# EAGLE design banana-split (EAGLE 6.6.0)
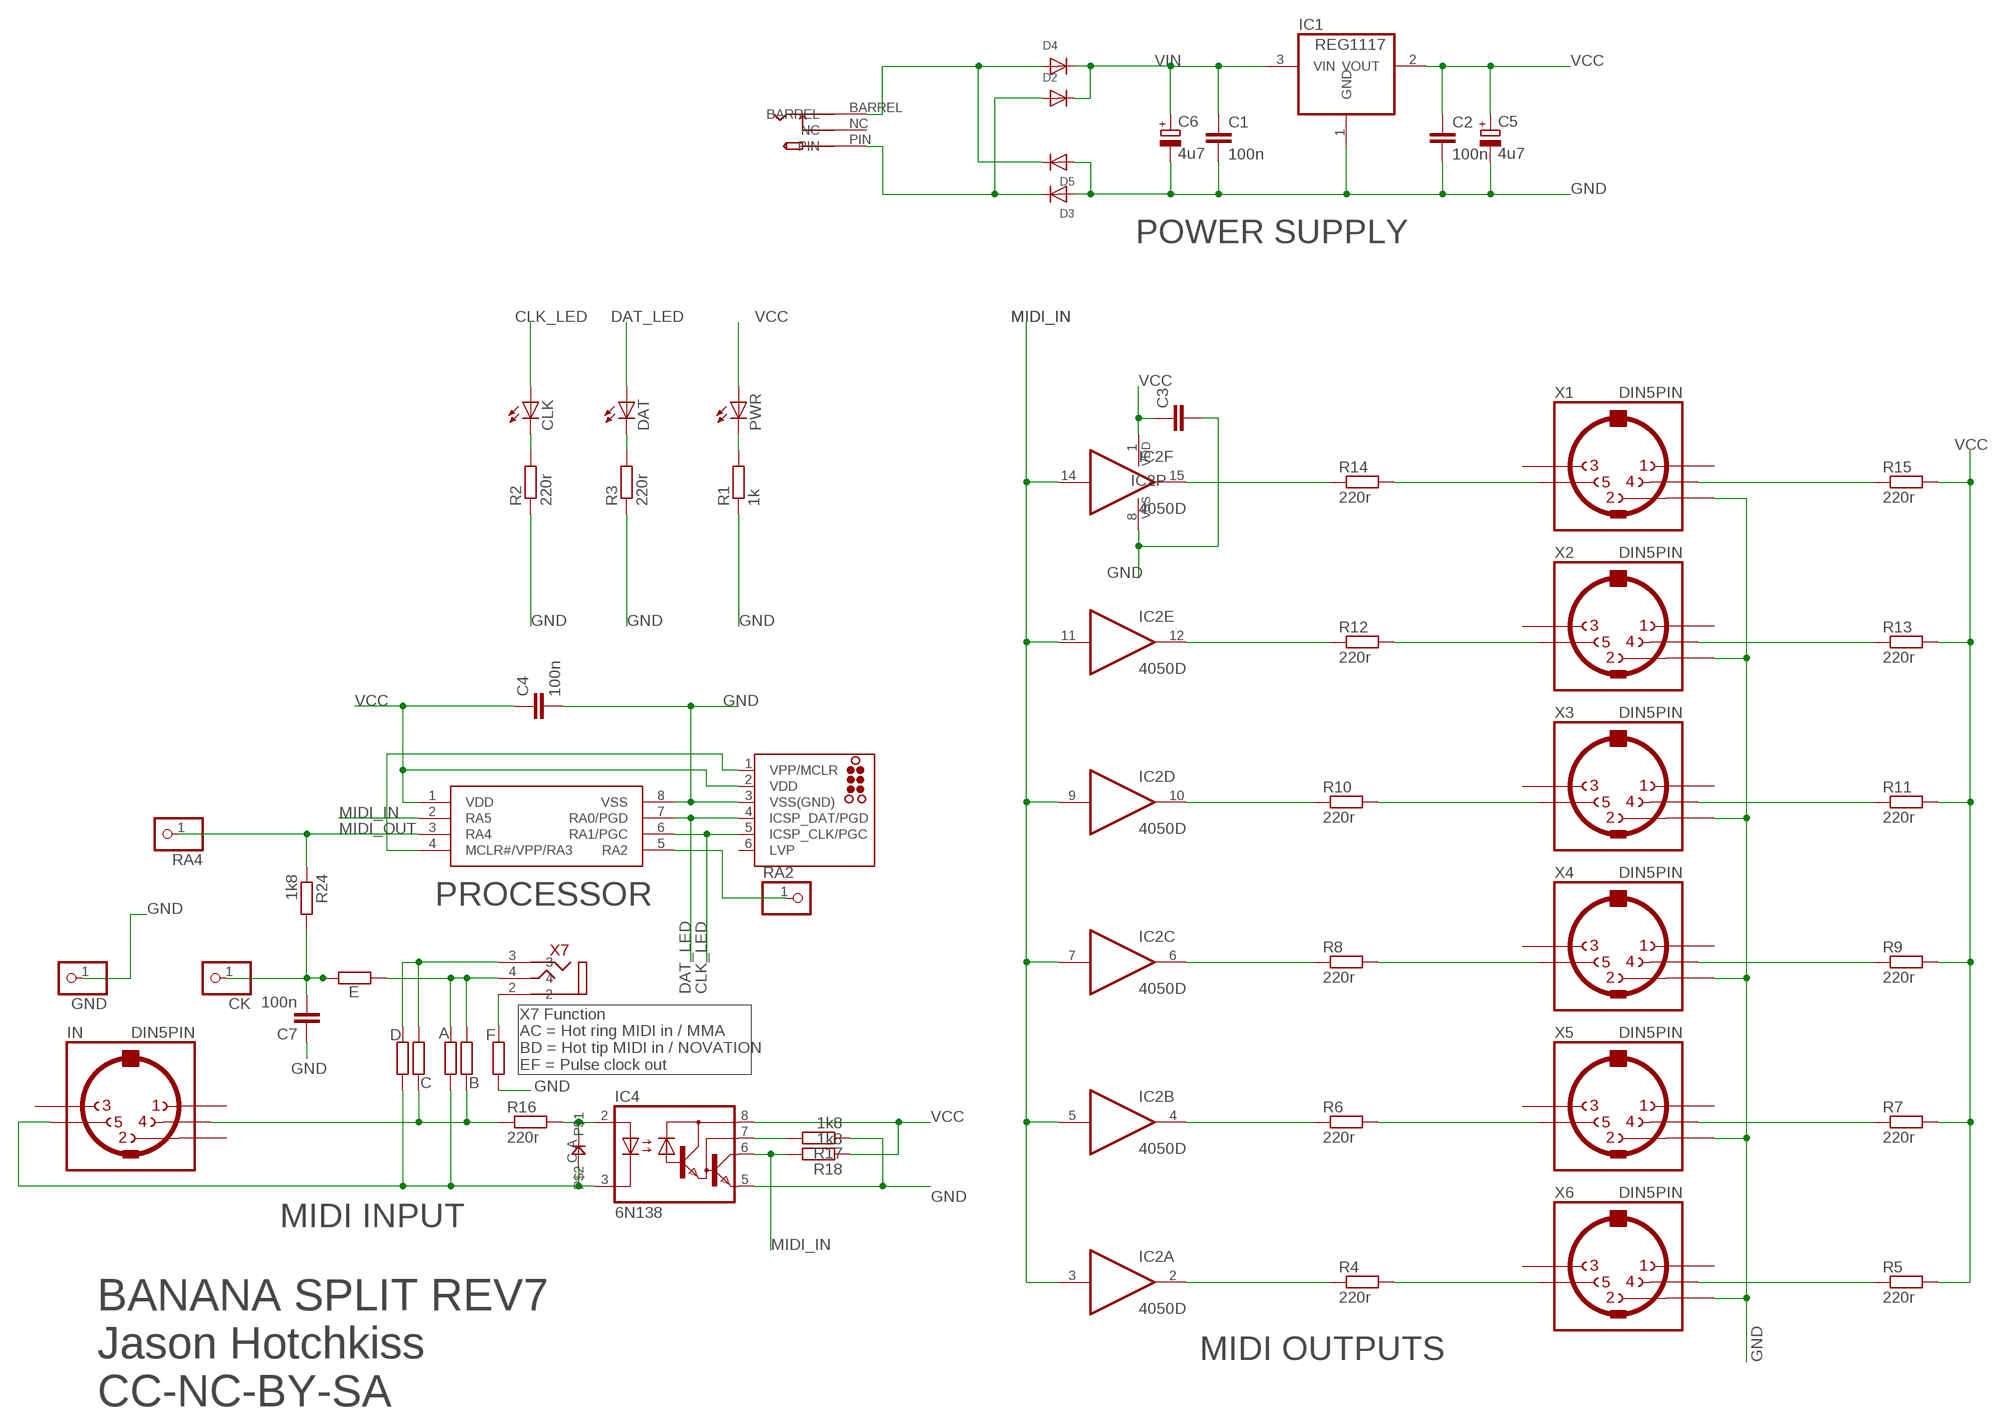
[diagram p0: schematic, sheet 1]

## Parts
A  1k8  R-EU_R0805  [R0805]
B  1k8  R-EU_R0805  [R0805]
C  1k8  R-EU_R0805  [R0805]
C1  100n  C-EUC0805  [C0805]
C2  100n  C-EUC0805  [C0805]
C3  C-EUC0805  [C0805]
C4  100n  C-EUC0805  [C0805]
C5  4u7  CPOL-EUE2-4  [E2-4]
C6  4u7  CPOL-EUE2-4  [E2-4]
C7  100n  C-EUC0805  [C0805]
CK  PINHD-1X1  [1X01]
CLK  LED3MM  [LED3MM]
D  1k8  R-EU_R0805  [R0805]
D1  0805DIODE  [0805DIODE]
D2  DIODESOD-123  [SOD-123]
D3  DIODESOD-123  [SOD-123]
D4  DIODESOD-123  [SOD-123]
D5  DIODESOD-123  [SOD-123]
DAT  LED3MM  [LED3MM]
E  1k8  R-EU_R0805  [R0805]
F  1k8  R-EU_R0805  [R0805]
GND  PINHD-1X1  [1X01]
IC1  REG1117  [SOT223]
IC2  4050D  [SO16]
IC3  PIC12F1822SO08  [SO08]
IC4  6N138  [DIL08]
ICSP  TC2030-MCP-NL  [TC2030-MCP-NL]
IN  DIN5PIN  [EDGEDIN]
PWR  LED3MM  [LED3MM]
R1  1k  R-EU_R0805  [R0805]
R2  220r  R-EU_R0805  [R0805]
R3  220r  R-EU_R0805  [R0805]
R4  220r  R-EU_R0805  [R0805]
R5  220r  R-EU_R0805  [R0805]
R6  220r  R-EU_R0805  [R0805]
R7  220r  R-EU_R0805  [R0805]
R8  220r  R-EU_R0805  [R0805]
R9  220r  R-EU_R0805  [R0805]
R10  220r  R-EU_R0805  [R0805]
R11  220r  R-EU_R0805  [R0805]
R12  220r  R-EU_R0805  [R0805]
R13  220r  R-EU_R0805  [R0805]
R14  220r  R-EU_R0805  [R0805]
R15  220r  R-EU_R0805  [R0805]
R16  220r  R-EU_R0805  [R0805]
R17  1k8  R-EU_R0805  [R0805]
R18  1k8  R-EU_R0805  [R0805]
R24  1k8  R-EU_R0805  [R0805]
RA2  PINHD-1X1  [1X01]
RA4  PINHD-1X1  [1X01]
U$1  PWR_SOCKET_2_1MM  [PWR_SOCKET_2_1MM]
X1  DIN5PIN  [EDGEDIN]
X2  DIN5PIN  [EDGEDIN]
X3  DIN5PIN  [EDGEDIN]
X4  DIN5PIN  [EDGEDIN]
X5  DIN5PIN  [EDGEDIN]
X6  DIN5PIN  [EDGEDIN]
X7  VERTICAL_3_5MM_SOCKET  [VERTICAL_3_5MM_SOCKET]

## Nets
CLK: CLK.K(C) R2.2
CLK_LED: CLK.A IC3.6(RA1/PGC) ICSP.5(ICSP_CLK/PGC)
DAT_LED: DAT.A IC3.7(RA0/PGD) ICSP.4(ICSP_DAT/PGD)
GND: C1.2 C2.2 C3.2 C4.2 C5.- C6.- C7.1 D3.A D5.A F.1 GND.1 IC1.1(GND) IC2.8(P:VSS) IC3.8(VSS) IC4.5(GND) ICSP.3(VSS(GND)) R1.1 R2.1 R3.1 R17.1 X1.2 X2.2 X3.2 X4.2 X5.2 X6.2
MIDI_IN: IC2.3(A:I) IC2.5(B:I) IC2.7(C:I) IC2.9(D:I) IC2.11(E:I) IC2.14(F:I) IC3.2(RA5) IC4.6(VO) R18.2
MIDI_OUT: IC3.3(RA4) R24.1 RA4.1
N$1: R14.2 X1.5
N$2: R12.2 X2.5
N$3: R10.2 X3.5
N$4: R8.2 X4.5
N$5: R6.2 X5.5
N$6: R4.2 X6.5
N$7: IC2.15(F:O) R14.1
N$8: IC2.12(E:O) R12.1
N$9: IC2.10(D:O) R10.1
N$10: IC2.6(C:O) R8.1
N$11: IC2.2(A:O) R4.1
N$12: IC2.4(B:O) R6.1
N$13: PWR.K(C) R1.2
N$14: R15.1 X1.4
N$15: R13.1 X2.4
N$16: R11.1 X3.4
N$17: R9.1 X4.4
N$18: R7.1 X5.4
N$19: R5.1 X6.4
N$20: B.1 C.1 IN.4 R16.1
N$21: D1.A IC4.2(A) R16.2
N$22: IC4.7(VB) R17.2
N$23: DAT.K(C) R3.2
N$24: A.1 D1.C D.1 IC4.3(C) IN.5
N$25: IC3.5(RA2) RA2.1
N$26: C.2 D.2 X7.3
N$27: D4.A D5.C U$1.BARREL
N$28: D2.A D3.C U$1.PIN
N$29: F.2 X7.2
N$30: A.2 B.2 E.2 X7.4
N$31: C7.2 CK.1 E.1 R24.2
N$33: IC3.4(MCLR#/VPP/RA3) ICSP.1(VPP/MCLR)
VCC: C2.1 C3.1 C4.1 C5.+ IC1.2(VOUT) IC2.1(P:VDD) IC3.1(VDD) IC4.8(VCC) ICSP.2(VDD) PWR.A R5.2 R7.2 R9.2 R11.2 R13.2 R15.2 R18.1
VIN: C1.1 C6.+ D2.C D4.C IC1.3(VIN)
Unconnected: ICSP.6(LVP) IN.1 IN.2 IN.3 U$1.NC X1.1 X1.3 X2.1 X2.3 X3.1 X3.3 X4.1 X4.3 X5.1 X5.3 X6.1 X6.3

## Notes on the sheet
- POWER SUPPLY
- PROCESSOR
- X7 Function
  AC = Hot ring MIDI in / MMA
  BD = Hot tip MIDI in / NOVATION
  EF = Pulse clock out
- MIDI INPUT
- BANANA SPLIT REV7
- MIDI OUTPUTS
- Jason Hotchkiss
  CC-NC-BY-SA

## Library data of the parts
A B C D E F R1-R18 R24 = rcl:R-EU_: RESISTOR, European symbol
C1-C4 C7 = rcl:C-EU: CAPACITOR, European symbol
C5 C6 = rcl:CPOL-EU: POLARIZED CAPACITOR, European symbol
CK GND RA2 RA4 = pinhead:PINHD-1X1: PIN HEADER
CLK DAT PWR = led:LED: LED OSRAM: - CHIPLED LG R971, LG N971, LY N971, LG Q971, LY Q971, LO R971, LY R971 LH N974, LH R974 LS Q976, LO Q976, LY Q976 LO Q996 - Hyper CHIPLED LW Q18S LB Q993, LB Q99A, LB R99A - SideLED LS A670, LO A670, LY A670, LG A670, LP A670 LB A673, LV A673, LT A673, LW A673 LH A674 LY A675 LS A676, LA A676, LO A676, LY A676, LW A676 LS A679, LY A679, LG A679 - Hyper Micro SIDELED® LS Y876, LA Y876, LO Y876, LY Y876 LT Y87S - SmartLED LW L88C, LW L88S LB L89C, LB L89S, LG L890 LS L89K, LO L89K, LY L89K LS L896, LA L896, LO L896, LY L896 - TOPLED LS T670, LO T670, LY T670, LG T670, LP T670 LSG T670, LSP T670, LSY T670, LOP T670, LYG T670 LG T671, LOG T671, LSG T671 LB T673, LV T673, LT T673, LW T673 LH T674 LS T676, LA T676, LO T676, LY T676, LB T676, LH T676, LSB T676, LW T676 LB T67C, LV T67C, LT T67C, LS T67K, LO T67K, LY T67K, LW E67C LS E67B, LA E67B, LO E67B, LY E67B, LB E67C, LV E67C, LT E67C LW T67C LS T679, LY T679, LG T679 LS T770, LO T770, LY T770, LG T770, LP T770 LB T773, LV T773, LT T773, LW T773 LH T774 LS E675, LA E675, LY E675, LS T675 LS T776, LA T776, LO T776, LY T776, LB T776 LHGB T686 LT T68C, LB T68C - Hyper Mini TOPLED® LB M676 - Mini TOPLED Santana® LG M470 LS M47K, LO M47K, LY M47K Source: http://www.osram.convergy.de LUXEON: - LUMILED® LXK2-PW12-R00, LXK2-PW12-S00, LXK2-PW14-U00, LXK2-PW14-V00 LXK2-PM12-R00, LXK2-PM12-S00, LXK2-PM14-U00 LXK2-PE12-Q00, LXK2-PE12-R00, LXK2-PE12-S00, LXK2-PE14-T00, LXK2-PE14-U00 LXK2-PB12-K00, LXK2-PB12-L00, LXK2-PB12-M00, LXK2-PB14-N00, LXK2-PB14-P00, LXK2-PB14-Q00 LXK2-PR12-L00, LXK2-PR12-M00, LXK2-PR14-Q00, LXK2-PR14-R00 LXK2-PD12-Q00, LXK2-PD12-R00, LXK2-PD12-S00 LXK2-PH12-R00, LXK2-PH12-S00 LXK2-PL12-P00, LXK2-PL12-Q00, LXK2-PL12-R00 Source: www.luxeon.com KINGBRIGHT: KA-3528ASYC Source: www.kingbright.com
D1 = jasons_stuff:0805DIODE
D2-D5 = adafruit:DIODE: Diode SMADIODE - SMA Surface Mount Package 20V 1A Schottky Diode Digikey: 641-1014-6-ND DO-1N4148 - Through Hole Small Current Diode SOD-123 20V 1 A (.5mV Vf) Schottky Diode - Digikey: MBRX120TPMSCT-ND SOD-323 10V 570mA (.38mV Vf, 3ns) Schottky Diode - Digikey: ZLLS410CT-ND SOD-523 30V 30mA Schottky Diode (RB751S-40TE61) - Digikey: RB751S-40TE61CT-ND SOT23-R/W - SOT23 Package (R = Solder Paste/Reflow Ovens, W = Hand-Soldering) BAT54Film 40V 300mA - Digikey: 497-7162-1-ND
IC1 = burr-brown:REG1117: 800mA and 1A Low Dropout (LDO) Positive Regulator 1.8V, 2.5V, 2.85V, 3.3V, 5V, and Adj; MPN: REG1117; OC_FARNELL: 1097566; OC_NEWARK: 14P6981
IC2 = 40xx:4050: Hex non-inverting BUFFER
IC3 = jasons_stuff:PIC12F1822
IC4 = optocoupler:6N138: MOTOROLA OPTO COUPLER; MF: VISHAY/TELEFUNKEN; MPN: 6N138; OC_FARNELL: 9860150; OC_NEWARK: 35K5294
ICSP = tag-connect:TC2030: TAG-CONNECT ICSP Connector Manufacturer: Tag-Connect <http://www.tag-connect.com> Cable for easy In-Circuit Serial Programming. Designed for Microchip ICD2, suitable for many others. Two variants - one "with legs" (for hands-free fit on PCB) and another "without legs" for quick programming. PAD Description 1 MCLR/Vpp 2 Vdd 3 GND 4 PGD (ISPDAT) 5 PGC (ISPCLK) 6 nc (used for LVP) ©2009 ROFA.cz - modified and updated by Robert Darlington ‹rdarlington@gmail.com›
IN X1-X6 = jason_eagle6:DIN5PIN: Female CONNECTOR 5 pins 90 deg. with shield, horizontal (DIN 41524)
U$1 = jason_eagle6:PWR_SOCKET_2_1MM
X7 = jason_eagle6:VERTICAL_3_5MM_SOCKET

## Board
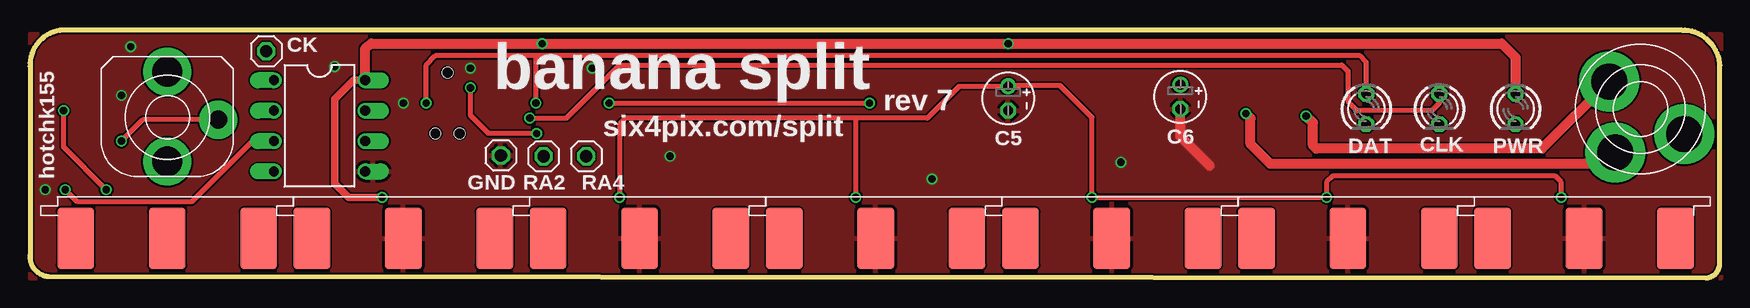
[diagram p1: board, top side]
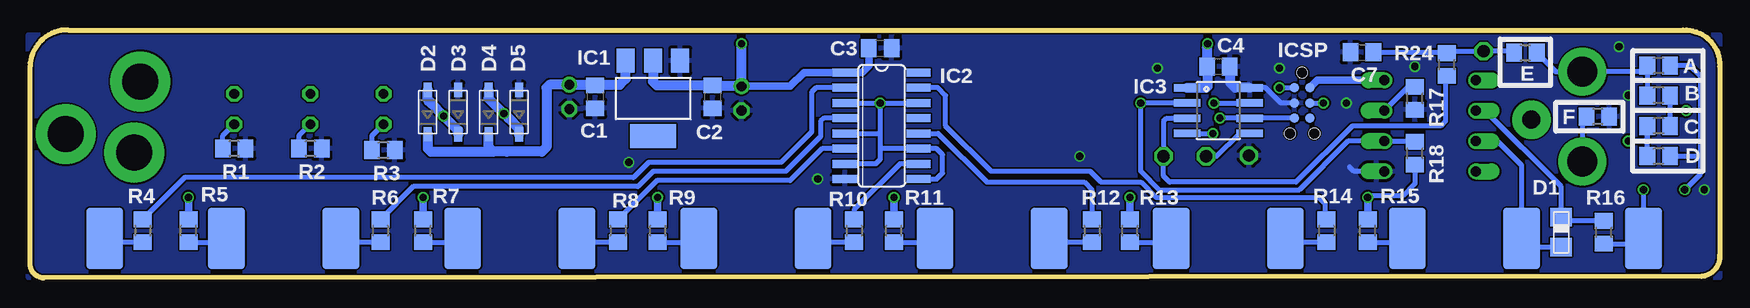
[diagram p2: board, bottom side, seen from below]

Size 140.85 x 20.7 mm. Coordinates in mm from the lower left corner, seen from the top.
Outline: 137.67,20.7 3.05,20.7 arc95 0,17.65 0,1.91 arc90 1.53,0.13 139.7,0 arc90 140.85,1.27 140.85,17.65 arc90 137.67,20.7
Copper layers (1*16): Top 0.035mm / dielectric 1.5mm / Bottom 0.035mm
Design rules "hackvana": minimum track width 6mil, minimum drill 0.3mm, track to track 6mil, track to pad 9mil, pad to pad 6mil, via to via 6mil, smd to smd 0mil, copper to edge 6mil, drill to drill 6mil, minimum pad ring 10mil, minimum via ring 6mil, stop-mask expansion 2mil, vias tented up to drill 100mil, thermal gap 10mil

### Footprints (pad centres in the part's own frame; a part is rotated, then mirrored left to right if it is on the bottom)
R0805 = smd 1.3 x 1.5: 1 -0.95,0; 2 0.95,0
C0805 = smd 1.3 x 1.5: 1 -0.95,0; 2 0.95,0
E2-4 = drill 0.813 pad 1.27: + -1.016,0 | drill 0.813 pad 1.27 octagon: - 1.016,0
1X01 = drill 1.016 octagon: 1 0,0
LED3MM = drill 0.813 octagon: A -1.27,0; K 1.27,0
0805DIODE = smd 1.524 x 1.778: A -1.262,-0.005; C 1.238,-0.005
SOD-123 = smd 1.2 x 0.7: A 1.85,0; C -1.85,0
SOT223 = smd 1.499 x 2.007: 1 -2.261,-3.15; 2 0.025,-3.15; 3 2.311,-3.15 | smd 3.81 x 2.007: 4 0,3.15
SO16 = smd 0.66 x 2.032: 1 -4.445,-3.073; 2 -3.175,-3.073; 3 -1.905,-3.073; 4 -0.635,-3.073; 5 0.635,-3.073; 6 1.905,-3.073; 7 3.175,-3.073; 8 4.445,-3.073; 9 4.445,3.073; 10 3.175,3.073; 11 1.905,3.073; 12 0.635,3.073; 13 -0.635,3.073; 14 -1.905,3.073; 15 -3.175,3.073; 16 -4.445,3.073
SO08 = smd 0.61 x 2.21: 1 -1.905,-2.616; 2 -0.635,-2.616; 3 0.635,-2.616; 4 1.905,-2.616; 5 1.905,2.616; 6 0.635,2.616; 7 -0.635,2.616; 8 -1.905,2.616
DIL08 = drill 0.813 offset: 1 -3.81,-3.81; 2 -1.27,-3.81; 3 1.27,-3.81; 4 3.81,-3.81; 5 3.81,3.81; 6 1.27,3.81; 7 -1.27,3.81; 8 -3.81,3.81
TC2030-MCP-NL = smd 0.787 x 0.787: 1 1.27,-0.635; 2 1.27,0.635; 3 2.54,-0.635; 4 2.54,0.635; 5 3.81,-0.635; 6 3.81,0.635 | hole 0.889: 0,0; 5.08,-1.016; 5.08,1.016
EDGEDIN = smd 3.048 x 5.08: 1 -7.62,-10.16; 2 0,-10.16; 3 7.62,-10.16 | smd 3.048 x 5.08 bottom: 4 -5.08,-10.16; 5 5.08,-10.16
PWR_SOCKET_2_1MM = drill 3 pad 5: BARREL 0,4.2; NC -4.2,0; PIN 3.4,-0.7
VERTICAL_3_5MM_SOCKET = drill 2.5 pad 4: 2 0,-3.75; 4 0,3.75 | drill 1.5 pad 3.2: 3 4.25,-0.25

### Placement (x,y rotation side)
A  5.08,17.72 180 bottom
B  5.08,15.24 180 bottom
C  5.08,12.7 180 bottom
C1  93.73,15.11 270 bottom
C2  83.95,15.11 270 bottom
C3  69.98,19.18 0 bottom
C4  41.79,17.65 0 bottom
C5  81.54,14.99 270 top
C6  95.89,15.11 270 top
C7  29.82,18.83 0 bottom
CK  19.69,18.92 0 top
CLK  117.48,14.1 270 top
D  5.08,10.16 180 bottom
D1  13.21,3.81 270 bottom
D2  107.7,13.84 90 bottom
D3  105.16,13.84 90 bottom
D4  102.62,13.84 90 bottom
D5  100.08,13.84 90 bottom
DAT  111.38,14.1 270 top
E  16.2,18.8 0 bottom
F  10.16,13.46 180 bottom
GND  39.25,10.22 0 top
IC1  88.9,14.99 180 bottom
IC2  69.85,12.7 270 bottom
IC3  41.79,13.97 270 bottom
IC4  24.13,12.7 270 top
ICSP  34.8,17.14 270 bottom
IN  11.43,13.46 0 top
PWR  123.83,14.1 270 top
R1  123.83,10.79 180 bottom
R2  117.48,10.79 180 bottom
R3  111.38,10.67 180 bottom
R4  131.45,3.94 270 bottom
R5  127.64,3.94 90 bottom
R6  111.64,3.94 270 bottom
R7  108.08,3.94 90 bottom
R8  91.83,3.94 270 bottom
R9  88.52,3.94 90 bottom
R10  72.14,3.94 270 bottom
R11  68.84,3.94 90 bottom
R12  52.33,3.94 270 bottom
R13  49.15,3.94 90 bottom
R14  32.77,3.94 270 bottom
R15  29.34,3.94 90 bottom
R16  9.66,3.81 90 bottom
R17  25.4,14.99 90 bottom
R18  25.4,10.41 90 bottom
R24  22.74,17.81 90 bottom
RA2  42.8,10.16 0 top
RA4  46.36,10.16 0 top
U$1  134.24,14.1 150 top
X1  31.12,13.46 0 top
X2  50.8,13.46 0 top
X3  70.49,13.46 0 top
X4  90.17,13.46 0 top
X5  109.86,13.46 0 top
X6  129.54,13.46 0 top
X7  11.43,13.46 0 top

### Tracks (layer width: path | path; a pad name or v marks a point on that pad's centre or on a via)
CLK
  Bottom 0.406: R2.2 118.43,11.88 CLK.K
CLK_LED  (via drill 0.6)
  Top 0.406: CLK.A 117.48,14.61 116.84,13.97 110.62,13.97 109.86,14.73 109.86,17.27 109.35,17.78 49.15,17.78 44.71,13.34 v41.66,13.34
  Bottom 0.406: ICSP.5 IC3.6 v41.66,13.34
DAT_LED  (via drill 0.6)
  Top 0.406: v33.02,14.61 33.02,17.78 33.79,18.54 42.3,18.54 | DAT.A 111.38,18.03 110.88,18.54 42.3,18.54 | v42.17,14.61 42.17,18.41 42.3,18.54
  Bottom 0.406: ICSP.4 v33.02,14.61 | v42.17,14.61 IC3.7
GND  (via drill 0.6)
  Top 0.813: 98.33,9.37 95.89,11.81 C6.-
  Bottom 0.406: IC4.5 30.48,8.89 30.87,9.27 | ICSP.3 36.58,14.61 37.85,15.88 IC3.8
  Bottom 0.813: IC3.8 40.39,15.88 40.77,16.26 40.77,17.59 C4.2
  other vias: 46.87,17.53 8.39,19.3 1.27,7.37 75.19,8.26 90.94,9.65 31.12,14.61 36.71,17.53 53.34,10.16 25.4,17.65 7.62,15.24
  pour Top: 0,20.32 0,0 140.97,0 140.97,20.32
  pour Bottom: 0,20.32 0,0 140.97,0 140.97,20.32
MIDI_IN  (via drill 0.6)
  Top 0.406: v48.26,14.61 v69.98,14.61
  Bottom 0.406: IC2.9 65.28,8.26 64.77,8.76 64.77,10.29 65.28,10.79 IC2.11 69.85,10.79 69.98,10.92 | IC2.3 v69.98,14.61 | IC3.2 v48.26,14.61 48.26,8.89 46.74,7.37 35.06,7.37 30.99,11.43 IC4.6 25.47,11.43 R18.2 | v69.98,14.61 IC2.14 | v69.98,14.61 69.98,12.06 | 69.98,12.06 69.98,10.92 | 69.98,10.92 69.98,9.91 70.36,9.53 IC2.7 | IC2.5 69.98,12.06
MIDI_OUT
  Bottom 0.406: IC3.3 46.11,13.34 46.36,13.08 RA4.1 46.36,8.51 45.85,8 35.31,8 30.61,12.7 23.25,12.7 22.86,13.08 22.86,16.86 R24.1
N$1
  Bottom 0.406: R14.2 36.39,2.99 | 36.39,2.99 36.83,2.54 | X1.5 36.2,3.17 36.39,2.99
N$2
  Bottom 0.406: R12.2 55.57,2.99 X2.5
N$3
  Bottom 0.406: R10.2 75.25,2.99 X3.5
N$4
  Bottom 0.406: R8.2 94.94,2.99 X4.5
N$5
  Bottom 0.406: R6.2 114.62,2.99 X5.5
N$6
  Bottom 0.406: R4.2 134.31,2.99 X6.5
N$7
  Bottom 0.406: IC2.15 65.16,15.88 64.52,15.24 64.52,12.7 60.71,8.89 52.46,8.89 51.57,8 48.26,8 46.99,6.73 33.41,6.73 32.9,6.22 32.9,5.01 R14.1
N$8
  Bottom 0.406: IC2.12 65.16,12.06 61.09,8 52.96,8 52.33,7.37 R12.1
N$9
  Bottom 0.406: IC2.10 68.33,9.53 72.14,5.71 R10.1
N$10
  Bottom 0.406: IC2.6 74.81,10.79 77.47,8.13 88.58,8.13 R8.1
N$11
  Bottom 0.406: IC2.2 75.32,15.88 75.7,15.49 75.7,12.19 78.24,9.65 89.29,9.65 90.56,8.38 127.95,8.38 R4.1
N$12
  Bottom 0.406: IC2.4 74.68,13.34 74.93,13.08 74.93,11.81 77.86,8.89 88.9,8.89 90.17,7.62 108.9,7.62 R6.1
N$13
  Bottom 0.406: R1.2 124.78,11.88 PWR.K
N$14
  Bottom 0.406: R15.1 26.35,2.99 X1.4
N$15
  Bottom 0.406: R13.1 46.04,2.99 X2.4
N$16
  Bottom 0.406: R11.1 65.72,2.99 X3.4
N$17
  Bottom 0.406: R9.1 85.41,2.99 X4.4
N$18
  Bottom 0.406: R7.1 105.09,2.99 X5.4
N$19
  Bottom 0.406: R5.1 124.78,2.99 X6.4
N$20  (via drill 0.6)
  Top 0.406: v6.35,7.37 2.8,10.92 v2.8,13.97
  Bottom 0.406: R16.1 6.67,2.86 6.35,2.54 | 6.35,2.54 IN.4 | v6.35,7.37 6.35,3.81 7.62,2.54 6.35,2.54 | C.1 4.13,13.97 | 4.13,13.97 B.1 | v2.8,13.97 4.13,13.97
N$21
  Bottom 0.406: R16.2 12.91,4.76 D1.A 13.22,7.62 19.56,13.97 IC4.2
N$22
  Bottom 0.406: R17.2 25.98,15.94 IC4.7
N$23
  Bottom 0.406: R3.2 112.33,11.88 DAT.K
N$24  (via drill 0.6)
  Top 0.406: IC4.3 18.55,11.43 13.47,6.35 3.94,6.35 v2.93,7.37
  Bottom 0.406: D1.C 16.48,2.57 16.51,2.54 IN.5 16.51,9.4 18.55,11.43 IC4.3 | D.1 1.59,10.16 | 1.59,10.16 1.59,8.7 v2.93,7.37 | 1.59,10.16 1.59,16.83 2.54,17.78 4.07,17.78 A.1
N$25
  Bottom 0.406: IC3.5 39.25,11.99 40.09,11.99 41.91,10.16 RA2.1
N$26  (via drill 0.6)
  Top 0.406: X7.3 9.41,13.21 v7.62,11.43
  Bottom 0.406: D.2 C.2 6.04,11.43 v7.62,11.43
N$27  (via drill 0.6)
  Top 0.813: U$1.BARREL 131.24,10.46 130.31,9.53 103.38,9.53 101.73,11.18 101.73,13.34 v101.35,13.72
  Bottom 0.813: D5.C 100.08,12.45 100.97,13.34 v101.35,13.72 102.62,14.99 D4.A
N$28  (via drill 0.6)
  Top 0.813: U$1.PIN 126.04,10.79 107.19,10.79 106.94,11.05 106.94,12.95 v106.37,13.53
  Bottom 0.813: D3.C 105.16,12.32 v106.37,13.53 107.38,14.54 107.7,14.86 D2.A
N$29
  Bottom 0.406: F.2 11.43,13.14 X7.2
N$30
  Bottom 0.406: E.2 13.66,17.21 X7.4 6.54,17.21 A.2 B.2
N$31
  Bottom 0.406: C7.2 22.74,18.83 | 22.74,18.83 R24.2 | 22.74,18.83 22.64,18.92 CK.1 17.27,18.92 E.1
N$33  (via drill 0.6)
  Top 0.406: v42.23,12.06 38.23,12.06 36.71,13.59 v36.71,15.88
  Bottom 0.406: IC3.4 v42.23,12.06 | v36.71,15.88 ICSP.1
VCC  (via drill 0.6)
  Top 0.406: v127.64,6.73 127.64,8 127.13,8.51 108.59,8.51 108.08,8 v108.08,6.73 v88.52,6.73 88.52,13.4 85.86,16.06 81.6,16.06 C5.+ 77.47,16 74.81,13.34 68.84,13.34 | 68.84,13.34 49.66,13.34 49.15,12.83 v49.15,6.73 | v68.84,6.73 68.84,13.34
  Top 0.61: IC4.8 26.99,16.51 25.4,14.92 25.4,7.87 26.55,6.73 v29.34,6.73
  Top 0.813: IC4.8 27.94,19.18 28.45,19.56 v42.68,19.56 v81.54,19.56 122.69,19.56 123.83,18.41 PWR.A
  Bottom 0.406: R18.1 25.4,7.87 26.42,6.86 29.21,6.86 v29.34,6.73
  Bottom 0.61: R15.2 v29.34,6.73 | v127.64,6.73 R5.2 | R13.2 v49.15,6.73 | R11.2 v68.84,6.73 | R9.2 v88.52,6.73 | R7.2 v108.08,6.73 | C3.1 70.93,17.72 71.51,17.14 IC2.1 76.33,17.14 77.47,16 C5.+ | IC4.8 33.53,16.51 ICSP.2
  Bottom 0.813: v42.68,19.56 42.74,19.12 C4.1 42.68,17.59 42.68,16 42.8,15.88 IC3.1 | IC1.2 88.93,16.41 88.58,16.06 C2.1 83.89,16 C5.+ v81.54,19.56
VIN
  Bottom 0.813: 93.98,16.13 C6.+ 97.54,16.13 97.79,15.88 97.79,10.92 98.18,10.54 101.1,10.54 102.24,10.54 | 93.98,16.13 91.7,16.13 91.19,16.64 91.19,18.11 IC1.3 | C1.1 93.92,16.06 93.98,16.13 | 102.24,10.54 102.62,10.92 D4.C | D2.C 107.7,10.79 107.45,10.54 102.24,10.54

### Text on the board
tPlace: banana split | rev 7 | six4pix.com/split | hotchk155